# EAGLE schematic BeagleBone_Black_egl (EAGLE 6.2), part 2 of 2
## Sheet 10 of 11
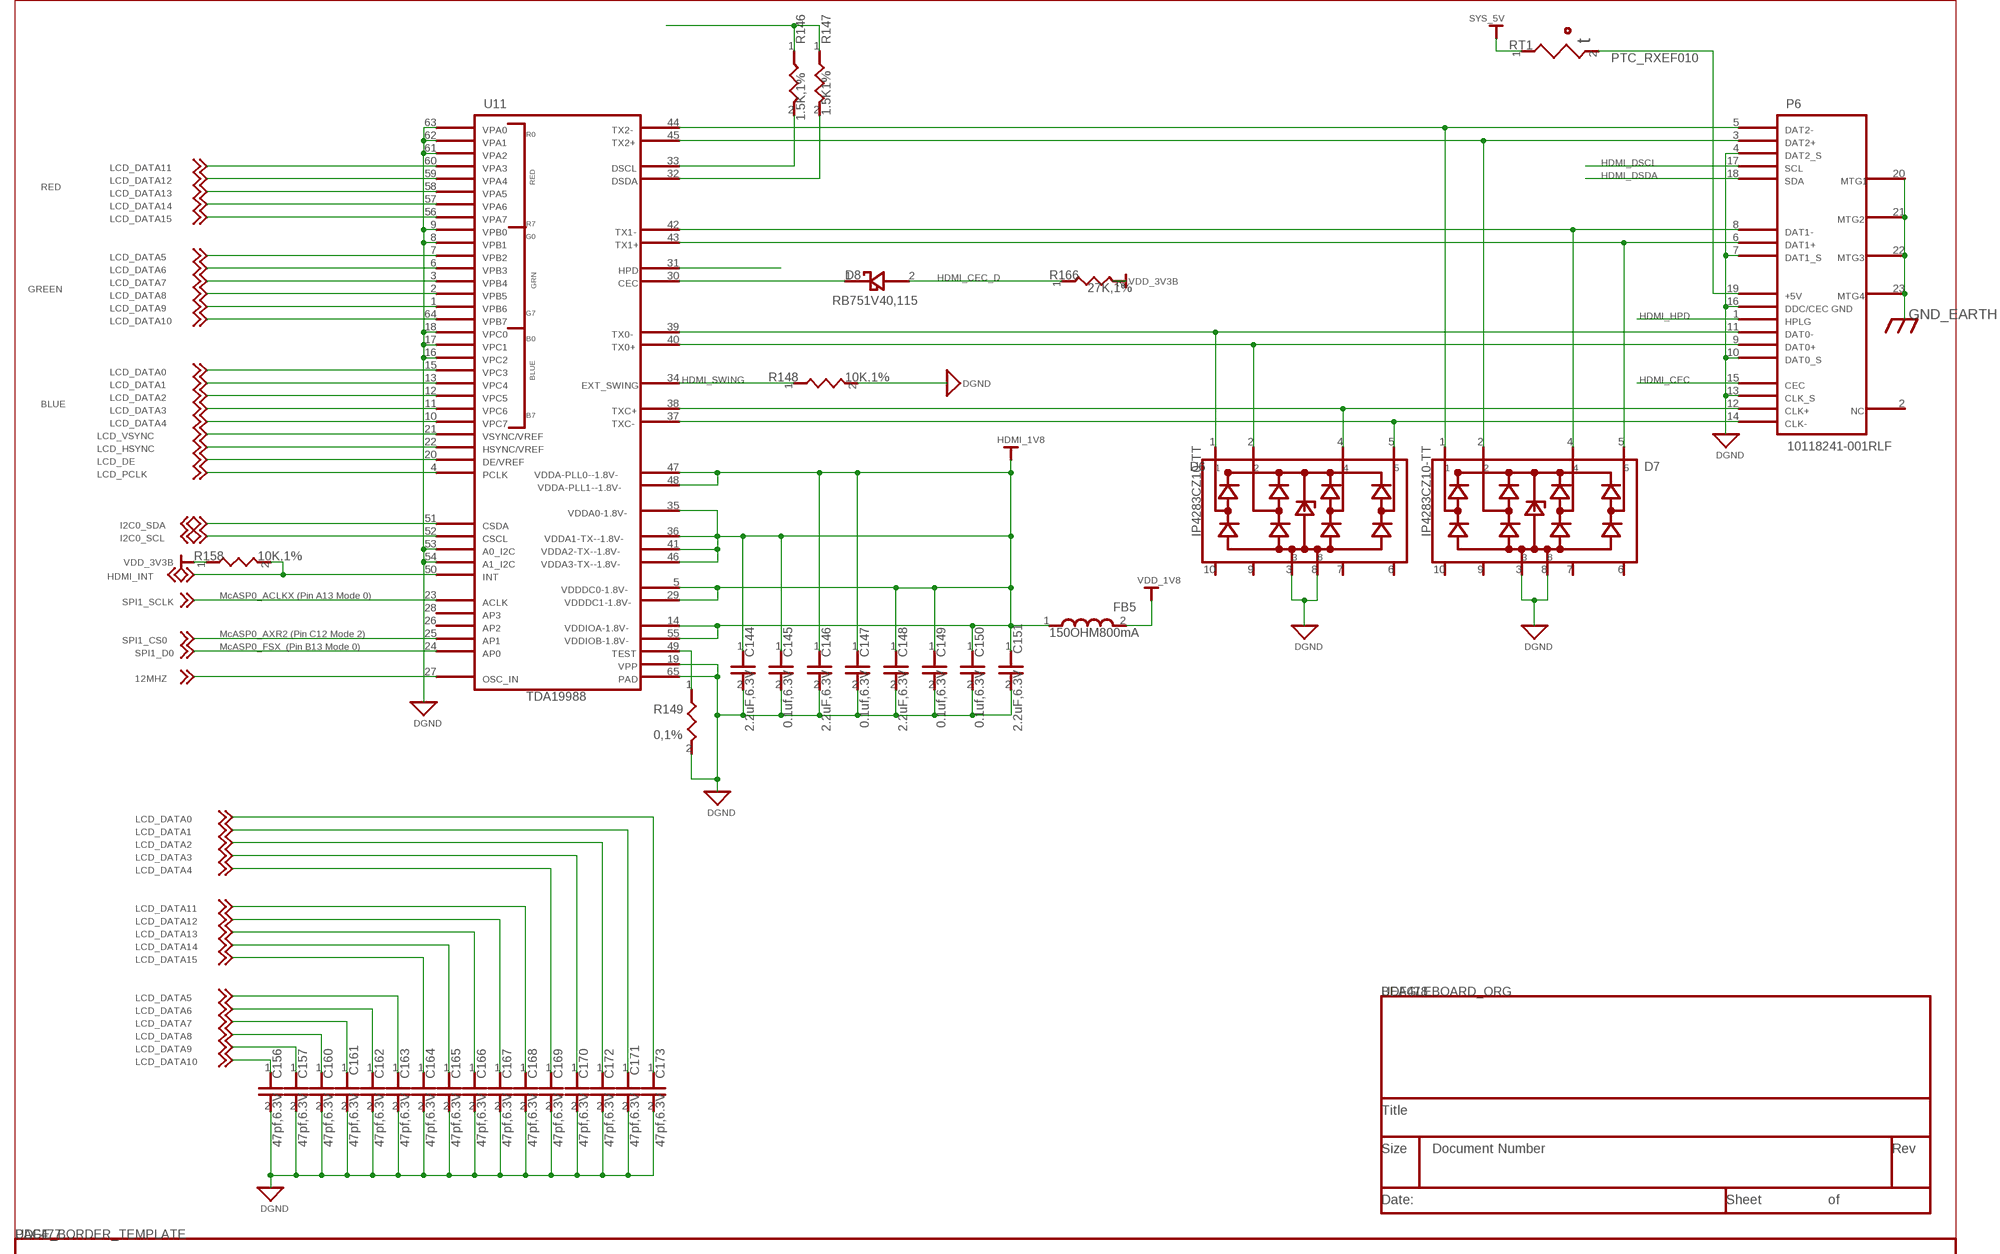
[diagram p12: schematic, sheet 10]

### Parts
C144  2.2uF,6.3V  CAP_2.2UF_X5R_6.3V_10%_0402_402  [402]
C145  0.1uf,6.3V  CAP_0.1UF_X5R_6.3V_20%_0201__40  [402]
C146  2.2uF,6.3V  CAP_2.2UF_X5R_6.3V_10%_0402_402  [402]
C147  0.1uf,6.3V  CAP_0.1UF_X5R_6.3V_20%_0201__40  [402]
C148  2.2uF,6.3V  CAP_2.2UF_X5R_6.3V_10%_0402_402  [402]
C149  0.1uf,6.3V  CAP_0.1UF_X5R_6.3V_20%_0201__40  [402]
C150  0.1uf,6.3V  CAP_0.1UF_X5R_6.3V_20%_0201__40  [402]
C151  2.2uF,6.3V  CAP_2.2UF_X5R_6.3V_10%_0402_402  [402]
C156  47pf,6.3V  CAP_0.1UF_X5R_6.3V_20%_0201_1  [402]
C157  47pf,6.3V  CAP_0.1UF_X5R_6.3V_20%_0201_1  [402]
C160  47pf,6.3V  CAP_0.1UF_X5R_6.3V_20%_0201_1  [402]
C161  47pf,6.3V  CAP_0.1UF_X5R_6.3V_20%_0201_1  [402]
C162  47pf,6.3V  CAP_0.1UF_X5R_6.3V_20%_0201_1  [402]
C163  47pf,6.3V  CAP_0.1UF_X5R_6.3V_20%_0201_1  [402]
C164  47pf,6.3V  CAP_0.1UF_X5R_6.3V_20%_0201_1  [402]
C165  47pf,6.3V  CAP_0.1UF_X5R_6.3V_20%_0201_1  [402]
C166  47pf,6.3V  CAP_0.1UF_X5R_6.3V_20%_0201_1  [402]
C167  47pf,6.3V  CAP_0.1UF_X5R_6.3V_20%_0201_1  [402]
C168  47pf,6.3V  CAP_0.1UF_X5R_6.3V_20%_0201_1  [402]
C169  47pf,6.3V  CAP_0.1UF_X5R_6.3V_20%_0201_1  [402]
C170  47pf,6.3V  CAP_0.1UF_X5R_6.3V_20%_0201_1  [402]
C171  47pf,6.3V  CAP_0.1UF_X5R_6.3V_20%_0201_1  [402]
C172  47pf,6.3V  CAP_0.1UF_X5R_6.3V_20%_0201_1  [402]
C173  47pf,6.3V  CAP_0.1UF_X5R_6.3V_20%_0201_1  [402]
D6  IP4283CZ10-TT  32CTQ030/TO_1_TSSOP10_IP4283CZ1  [TSSOP10]
D7  IP4283CZ10-TT  32CTQ030/TO_1_TSSOP10_IP4283CZ1  [TSSOP10]
D8  RB751V40,115  DIO_SR305_TH_0_SOD323_RB751V40_  [SOD323]
FB5  150OHM800mA  FER_180_200_0805_SM-7351-IND-08  [SM-7351-IND-0805]
P6  10118241-001RLF  CONN_HDMI_TYPED_CONN19_HDMI_101  [CONN19_HDMI]
R146  1.5K,1%  RES_1.5K_1/16W_5%_0402_402_1.5K_2  [402]
R147  1.5K1%  RES_1.5K_1/16W_5%_0402_402_1._1  [402]
R148  10K,1%  RES_10K_1/16W_1%_0402_402_10K_1_2  [402]
R149  0,1%  RES_0_1/16W_1%_0402_402_0_1%_2  [402]
R158  10K,1%  RES_10K_1/16W_1%_0402_402_10K_1_2  [402]
R166  27K,1%  RES_22.6K_1/16W_1%_0402_402_27K  [402]
RT1  PTC_RXEF010  PTC_RXEF010_POLYSW200-5638-310_  [POLYSW200-5638-310]
U11  TDA19988  IC_TDA19988_HVQFN64_5_QFN64S9X9  [QFN64S9X9P5]

### Nets
12MHZ: U11.27 ; also sheet 3
DGND: C144.2 C145.2 C146.2 C147.2 C148.2 C149.2 C150.2 C151.2 C156.2 C157.2 C160.2 C161.2 C162.2 C163.2 C164.2 C165.2 C166.2 C167.2 C168.2 C169.2 C170.2 C171.2 C172.2 C173.2 D6.3 D6.8 D7.3 D7.8 P6.4 P6.7 P6.10 P6.13 P6.16 R148.2 R149.2 U11.8 U11.9 U11.16 U11.17 U11.18 U11.19 U11.53 U11.54 U11.61 U11.62 U11.63 U11.65 ; supply symbol labelled GND_SIGNAL_DGND ; also sheet 2,3,4,5,6,7,8,9,11
DVI_+5V: P6.19 R146.1 R147.1 RT1.2
GND_EARTH: P6.20 P6.21 P6.22 P6.23 ; supply symbol labelled GND_EARTH_GND_EARTH ; also sheet 2,4,9,11
HDMI_1V8: C144.1 C145.1 C146.1 C147.1 C148.1 C149.1 C150.1 C151.1 FB5.1 U11.5 U11.14 U11.29 U11.35 U11.36 U11.41 U11.46 U11.47 U11.48 U11.55 ; supply symbol labelled VCC_BAR_HDMI_1V8
HDMI_CEC: D8.1 P6.15 U11.30
HDMI_CEC_D: D8.2 R166.1
HDMI_DSCL: P6.17 R146.2 U11.33
HDMI_DSDA: P6.18 R147.2 U11.32
HDMI_HPD: P6.1 U11.31
HDMI_INT: R158.2 U11.50 ; also sheet 3
HDMI_SWING: R148.1 U11.34
HDMI_TX0+: D6.2 P6.9 U11.40
HDMI_TX0-: D6.1 P6.11 U11.39
HDMI_TX1+: D7.5 P6.6 U11.43
HDMI_TX1-: D7.4 P6.8 U11.42
HDMI_TX2+: D7.2 P6.3 U11.45
HDMI_TX2-: D7.1 P6.5 U11.44
HDMI_TXC+: D6.4 P6.12 U11.38
HDMI_TXC-: D6.5 P6.14 U11.37
I2C0_SCL: U11.52 ; also sheet 2,4,11
I2C0_SDA: U11.51 ; also sheet 2,4,11
LCD_DATA0: C173.1 U11.15 ; also sheet 4,6,11
LCD_DATA1: C171.1 U11.13 ; also sheet 4,6,11
LCD_DATA2: C172.1 U11.12 ; also sheet 4,6,11
LCD_DATA3: C170.1 U11.11 ; also sheet 4,6,11
LCD_DATA4: C169.1 U11.10 ; also sheet 4,6,11
LCD_DATA5: C163.1 U11.7 ; also sheet 4,6,11
LCD_DATA6: C162.1 U11.6 ; also sheet 4,6,11
LCD_DATA7: C161.1 U11.3 ; also sheet 4,6,11
LCD_DATA8: C160.1 U11.2 ; also sheet 4,6,11
LCD_DATA9: C157.1 U11.1 ; also sheet 4,6,11
LCD_DATA10: C156.1 U11.64 ; also sheet 4,6,11
LCD_DATA11: C168.1 U11.60 ; also sheet 4,6,11
LCD_DATA12: C167.1 U11.59 ; also sheet 4,6,11
LCD_DATA13: C166.1 U11.58 ; also sheet 4,6,11
LCD_DATA14: C165.1 U11.57 ; also sheet 4,6,11
LCD_DATA15: C164.1 U11.56 ; also sheet 4,6,11
LCD_DE: U11.20 ; also sheet 4,11
LCD_HSYNC: U11.22 ; also sheet 4,11
LCD_PCLK: U11.4 ; also sheet 4,11
LCD_VSYNC: U11.21 ; also sheet 4,11
N21667305: R149.1 U11.49
SPI1_CS0: U11.25 ; also sheet 4,11
SPI1_D0: U11.24 ; also sheet 4,11
SPI1_SCLK: U11.23 ; also sheet 4,11
SYS_5V: RT1.1 ; supply symbol labelled VCC_BAR_SYS_5V ; also sheet 2,4,6,11
VDD_1V8: FB5.2 ; supply symbol labelled VCC_BAR_VDD_1V8 ; also sheet 2,5
VDD_3V3B: R158.1 R166.2 ; supply symbol labelled VCC_BAR_VDD_3V3B ; also sheet 2,3,4,8,9,11
Unconnected: D6.6 D6.7 D6.9 D6.10 D7.6 D7.7 D7.9 D7.10 P6.2 U11.26 U11.28

### Notes on the sheet
- SYS_5V
- HDMI_DSCL
- LCD_DATA11
- HDMI_DSDA
- LCD_DATA12
- RED
- LCD_DATA13
- LCD_DATA14
- LCD_DATA15
- LCD_DATA5
- LCD_DATA6
- HDMI_CEC_D
- LCD_DATA7 | VDD_3V3B
- GREEN
- LCD_DATA8
- LCD_DATA9
- HDMI_HPD | GND_EARTH
- LCD_DATA10
- LCD_DATA0
- HDMI_SWING | HDMI_CEC
- LCD_DATA1 | DGND
- LCD_DATA2
- BLUE
- LCD_DATA3
- LCD_DATA4
- LCD_VSYNC
- HDMI_1V8
- LCD_HSYNC
- DGND
- LCD_DE
- LCD_PCLK
- I2C0_SDA
- I2C0_SCL
- VDD_3V3B
- HDMI_INT
- VDD_1V8
- McASP0_ACLKX (Pin A13 Mode 0)
- SPI1_SCLK
- McASP0_AXR2 (Pin C12 Mode 2)
- SPI1_CS0
- McASP0_FSX  (Pin B13 Mode 0) | DGND | DGND
- SPI1_D0
- 12MHZ
- DGND
- DGND
- LCD_DATA0
- LCD_DATA1
- LCD_DATA2
- LCD_DATA3
- LCD_DATA4
- LCD_DATA11
- LCD_DATA12
- LCD_DATA13
- LCD_DATA14
- LCD_DATA15
- LCD_DATA5
- LCD_DATA6
- LCD_DATA7
- LCD_DATA8
- LCD_DATA9
- LCD_DATA10
- DGND

## Sheet 11 of 11
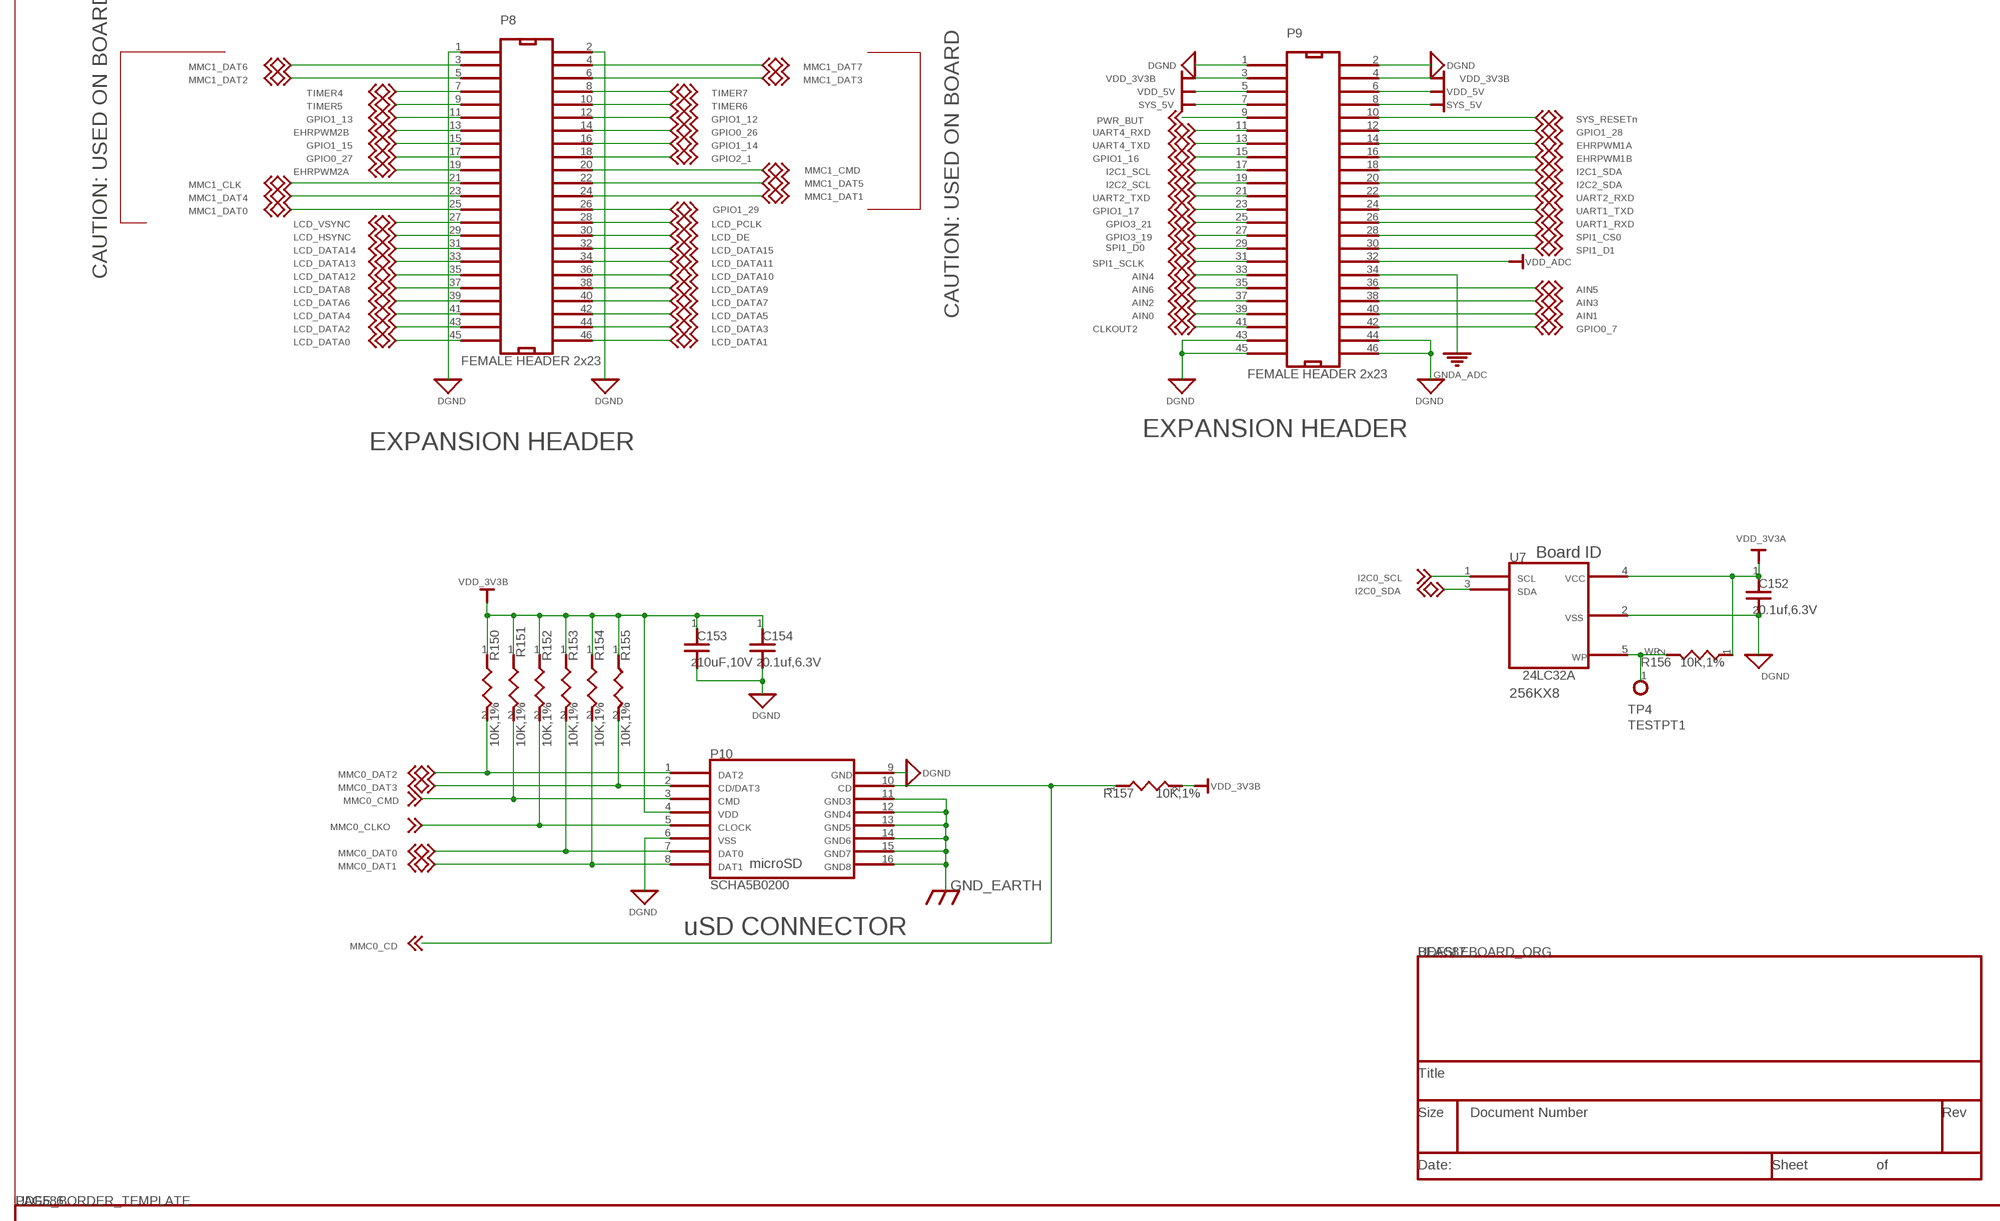
[diagram p13: schematic, sheet 11]

### Parts
C152  0.1uf,6.3V  CAP_0.1UF_X5R_6.3V_20%_0201__40  [402]
C153  10uF,10V  CAP_10UF_Y5V_10V_10%_0805_805_1  [805]
C154  0.1uf,6.3V  CAP_0.1UF_X5R_6.3V_20%_0201__40  [402]
P8  FEMALE HEADER 2x23  HDR_46_F_2_0.1_0.1_HEADER23X2_F  [HEADER23X2]
P9  FEMALE HEADER 2x23  HDR_46_F_2_0.1_0.1_HEADER23X2_F  [HEADER23X2]
P10  SCHA5B0200  MICROSD_CONN_8_SD-MICRO-SCHA5B0  [SD-MICRO-SCHA5B0300]
R150  10K,1%  RES_10K_1/16W_1%_0402_402_10K_1  [402]
R151  10K,1%  RES_10K_1/16W_1%_0402_402_10K_1  [402]
R152  10K,1%  RES_10K_1/16W_1%_0402_402_10K_1  [402]
R153  10K,1%  RES_10K_1/16W_1%_0402_402_10K_1  [402]
R154  10K,1%  RES_10K_1/16W_1%_0402_402_10K_1  [402]
R155  10K,1%  RES_10K_1/16W_1%_0402_402_10K_1  [402]
R156  10K,1%  RES_0_1/16W_1%_0402_402_10K_1%  [402]
R157  10K,1%  RES_10K_1/16W_1%_0402_402_10K_1  [402]
TP4  TESTPT1  TESTPT1_TP1-8040  [TP1-8040]
U7  24LC32A  MEM_24LC32_SOT23-5_SOT23-5_24LC  [SOT23-5]

### Nets
AIN0: P9.39 ; also sheet 4
AIN1: P9.40 ; also sheet 4
AIN2: P9.37 ; also sheet 4
AIN3: P9.38 ; also sheet 4
AIN4: P9.33 ; also sheet 4
AIN5: P9.36 ; also sheet 4
AIN6: P9.35 ; also sheet 4
CLKOUT2: P9.41 ; also sheet 3
DGND: C152.2 C153.2 C154.2 P8.1 P8.2 P9.1 P9.2 P9.43 P9.44 P9.45 P9.46 P10.6 P10.9 U7.2 ; supply symbol labelled GND_SIGNAL_DGND, GND_SIGNAL_2_DGND ; also sheet 2,3,4,5,6,7,8,9,10
EHRPWM1A: P9.14 ; also sheet 3
EHRPWM1B: P9.16 ; also sheet 3
EHRPWM2A: P8.19 ; also sheet 3
EHRPWM2B: P8.13 ; also sheet 3
GND_EARTH: P10.11 P10.12 P10.13 P10.14 P10.15 P10.16 ; supply symbol labelled GND_EARTH_GND_EARTH ; also sheet 2,4,9,10
GNDA_ADC: P9.34 ; supply symbol labelled GND_POWER_GNDA_ADC ; also sheet 4,5
GPIO0_7: P9.42 ; also sheet 4
GPIO0_26: P8.14 ; also sheet 3
GPIO0_27: P8.17 ; also sheet 3
GPIO1_12: P8.12 ; also sheet 3
GPIO1_13: P8.11 ; also sheet 3
GPIO1_14: P8.16 ; also sheet 3
GPIO1_15: P8.15 ; also sheet 3
GPIO1_16: P9.15 ; also sheet 3
GPIO1_17: P9.23 ; also sheet 3
GPIO1_28: P9.12 ; also sheet 3
GPIO1_29: P8.26 ; also sheet 3
GPIO2_1: P8.18 ; also sheet 3
GPIO3_19: P9.27 ; also sheet 4
GPIO3_21: P9.25 ; also sheet 3,4
I2C0_SCL: U7.1 ; also sheet 2,4,10
I2C0_SDA: U7.3 ; also sheet 2,4,10
I2C1_SCL: P9.17 ; also sheet 4
I2C1_SDA: P9.18 ; also sheet 4
I2C2_SCL: P9.19 ; also sheet 4
I2C2_SDA: P9.20 ; also sheet 4
LCD_DATA0: P8.45 ; also sheet 4,6,10
LCD_DATA1: P8.46 ; also sheet 4,6,10
LCD_DATA2: P8.43 ; also sheet 4,6,10
LCD_DATA3: P8.44 ; also sheet 4,6,10
LCD_DATA4: P8.41 ; also sheet 4,6,10
LCD_DATA5: P8.42 ; also sheet 4,6,10
LCD_DATA6: P8.39 ; also sheet 4,6,10
LCD_DATA7: P8.40 ; also sheet 4,6,10
LCD_DATA8: P8.37 ; also sheet 4,6,10
LCD_DATA9: P8.38 ; also sheet 4,6,10
LCD_DATA10: P8.36 ; also sheet 4,6,10
LCD_DATA11: P8.34 ; also sheet 4,6,10
LCD_DATA12: P8.35 ; also sheet 4,6,10
LCD_DATA13: P8.33 ; also sheet 4,6,10
LCD_DATA14: P8.31 ; also sheet 4,6,10
LCD_DATA15: P8.32 ; also sheet 4,6,10
LCD_DE: P8.30 ; also sheet 4,10
LCD_HSYNC: P8.29 ; also sheet 4,10
LCD_PCLK: P8.28 ; also sheet 4,10
LCD_VSYNC: P8.27 ; also sheet 4,10
MMC0_CD: P10.10 R157.1 ; also sheet 3,4
MMC0_CLKO: P10.5 R152.2 ; also sheet 3
MMC0_CMD: P10.3 R151.2 ; also sheet 3
MMC0_DAT0: P10.7 R153.2 ; also sheet 3
MMC0_DAT1: P10.8 R154.2 ; also sheet 3
MMC0_DAT2: P10.1 R150.2 ; also sheet 3
MMC0_DAT3: P10.2 R155.2 ; also sheet 3
MMC1_CLK: P8.21 ; also sheet 3,8
MMC1_CMD: P8.20 ; also sheet 3,8
MMC1_DAT0: P8.25 ; also sheet 3,8
MMC1_DAT1: P8.24 ; also sheet 3,8
MMC1_DAT2: P8.5 ; also sheet 3,8
MMC1_DAT3: P8.6 ; also sheet 3,8
MMC1_DAT4: P8.23 ; also sheet 3,8
MMC1_DAT5: P8.22 ; also sheet 3,8
MMC1_DAT6: P8.3 ; also sheet 3,8
MMC1_DAT7: P8.4 ; also sheet 3,8
PWR_BUT: P9.9 ; also sheet 2
SPI1_CS0: P9.28 ; also sheet 4,10
SPI1_D0: P9.29 ; also sheet 4,10
SPI1_D1: P9.30 ; also sheet 4
SPI1_SCLK: P9.31 ; also sheet 4,10
SYS_5V: P9.7 P9.8 ; supply symbol labelled VCC_BAR_SYS_5V ; also sheet 2,4,6,10
SYS_RESETN: P9.10 ; also sheet 3,9
TIMER4: P8.7 ; also sheet 3
TIMER5: P8.9 ; also sheet 3
TIMER6: P8.10 ; also sheet 3
TIMER7: P8.8 ; also sheet 3
UART1_RXD: P9.26 ; also sheet 4
UART1_TXD: P9.24 ; also sheet 4
UART2_RXD: P9.22 ; also sheet 4
UART2_TXD: P9.21 ; also sheet 4
UART4_RXD: P9.11 ; also sheet 3
UART4_TXD: P9.13 ; also sheet 3
VDD_3V3A: C152.1 R156.1 U7.4 ; supply symbol labelled VDD_1V8_VDD_3V3A ; also sheet 2,3,4,5,6
VDD_3V3B: C153.1 C154.1 P9.3 P9.4 P10.4 R150.1 R151.1 R152.1 R153.1 R154.1 R155.1 R157.2 ; supply symbol labelled VCC_BAR_VDD_3V3B ; also sheet 2,3,4,8,9,10
VDD_5V: P9.5 P9.6 ; supply symbol labelled VCC_BAR_VDD_5V ; also sheet 2
VDD_ADC: P9.32 ; supply symbol labelled VCC_BAR_VDD_ADC ; also sheet 4,5
WP: R156.2 TP4.1 U7.5

### Notes on the sheet
- MMC1_DAT6 | MMC1_DAT7 | DGND | DGND
- MMC1_DAT2 | MMC1_DAT3 | VDD_3V3B | VDD_3V3B
- TIMER4 | TIMER7 | VDD_5V | VDD_5V
- TIMER5 | TIMER6 | SYS_5V | SYS_5V
- GPIO1_13 | GPIO1_12 | PWR_BUT | SYS_RESETn
- EHRPWM2B | GPIO0_26 | UART4_RXD | GPIO1_28
- GPIO1_15 | GPIO1_14 | UART4_TXD | EHRPWM1A
- GPIO0_27 | GPIO2_1 | GPIO1_16 | EHRPWM1B
- EHRPWM2A | MMC1_CMD | I2C1_SCL | I2C1_SDA
- MMC1_CLK | MMC1_DAT5 | I2C2_SCL | I2C2_SDA
- MMC1_DAT4 | MMC1_DAT1 | UART2_TXD | UART2_RXD
- MMC1_DAT0 | GPIO1_29 | GPIO1_17 | UART1_TXD
- LCD_VSYNC | LCD_PCLK | GPIO3_21 | UART1_RXD
- LCD_HSYNC | LCD_DE | GPIO3_19 | SPI1_CS0
- LCD_DATA14 | LCD_DATA15 | SPI1_D0 | SPI1_D1
- LCD_DATA13 | LCD_DATA11 | SPI1_SCLK | VDD_ADC
- CAUTION: USED ON BOARD | LCD_DATA12 | LCD_DATA10 | AIN4
- LCD_DATA8 | LCD_DATA9 | AIN6 | AIN5
- LCD_DATA6 | LCD_DATA7 | AIN2 | AIN3
- LCD_DATA4 | LCD_DATA5 | CAUTION: USED ON BOARD | AIN0 | AIN1
- LCD_DATA2 | LCD_DATA3 | CLKOUT2 | GPIO0_7
- LCD_DATA0 | LCD_DATA1
- GNDA_ADC
- DGND | DGND | DGND | DGND
- EXPANSION HEADER
- EXPANSION HEADER
- VDD_3V3A
- Board ID
- I2C0_SCL
- VDD_3V3B
- I2C0_SDA
- WP
- DGND
- 256KX8
- DGND
- MMC0_DAT2 | DGND
- MMC0_DAT3 | VDD_3V3B
- MMC0_CMD
- MMC0_CLKO
- MMC0_DAT0
- MMC0_DAT1
- GND_EARTH
- DGND
- uSD CONNECTOR
- MMC0_CD

## Library data of the parts
C1 C2 C4 C7-C15 C39 C40 C55 C62 C77 C95 C96 C118 C122 C126 C133 C153 = BeagleBone_Black_egl:CAP_10UF_Y5V_10V_10%_0805_805_1: CAP_10UF_Y5V_10V_10%_0805_805_1
C3 C20 C27-C31 C33 C35-C38 C41-C54 C56-C61 C63-C76 C78-C88 C92-C94 C97-C103 C105-C117 C119-C121 C124 C127-C132 C135 C145 C147 C149 C150 C152 C154 C155 C158 C159 = BeagleBone_Black_egl:CAP_0.1UF_X5R_6.3V_20%_0201__40: CAP_0.1UF_X5R_6.3V_20%_0201__40
C16-C18 C125 C144 C146 C148 C151 = BeagleBone_Black_egl:CAP_2.2UF_X5R_6.3V_10%_0402_402: CAP_2.2UF_X5R_6.3V_10%_0402_402
C19 = BeagleBone_Black_egl:CAP_470PF_X7R_25V_10%_0402_402_: CAP_470PF_X7R_25V_10%_0402_402_
C21 C22 C25 C26 = BeagleBone_Black_egl:CAP_18PF_COG_50V_5%_0402_402_18: CAP_18PF_COG_50V_5%_0402_402_18
C24 C89-C91 C104 C134 = BeagleBone_Black_egl:CAP_1.0UF_X5R_10V_10%_0402_402_: CAP_1.0UF_X5R_10V_10%_0402_402_
C32 C123 = BeagleBone_Black_egl:CAP_0.001_X7R_50V_5%_0402_402_0: CAP_0.001_X7R_50V_5%_0402_402_0
C34 = BeagleBone_Black_egl:CAP_100UF_TANT_6.3V_3528-21_RD2: CAP_100UF_TANT_6.3V_3528-21_RD2
C136 = BeagleBone_Black_egl:470PF/5%/50V/C0G/0603_0_0402_47: 470PF/5%/50V/C0G/0603_0_0402_47
C137-C140 = BeagleBone_Black_egl:CAP_0402_100PF_COG_50V_402_15PF: CAP_0402_100PF_COG_50V_402_15PF
C141 = BeagleBone_Black_egl:CAP_0402_0.1UF_X5R_10V_402_0.02: CAP_0402_0.1UF_X5R_10V_402_0.02
C142 C143 = BeagleBone_Black_egl:CAP_30PF_COG_50V_5%_0402_402_30: CAP_30PF_COG_50V_5%_0402_402_30
C156 C157 C160-C173 = BeagleBone_Black_egl:CAP_0.1UF_X5R_6.3V_20%_0201_1: CAP_0.1UF_X5R_6.3V_20%_0201_1
D1-D5 = BeagleBone_Black_egl:LED_LTST-C150GKT_0_LED_0603_DIS: LED_LTST-C150GKT_0_LED_0603_DIS
D6 D7 = BeagleBone_Black_egl:32CTQ030/TO_1_TSSOP10_IP4283CZ1: 32CTQ030/TO_1_TSSOP10_IP4283CZ1
D8 = BeagleBone_Black_egl:DIO_SR305_TH_0_SOD323_RB751V40_: DIO_SR305_TH_0_SOD323_RB751V40_
FB1-FB4 FB7 = BeagleBone_Black_egl:FER_180_200_0_SM-7351-IND-0805_: FER_180_200_0_SM-7351-IND-0805_
FB5 = BeagleBone_Black_egl:FER_180_200_0805_SM-7351-IND-08: FER_180_200_0805_SM-7351-IND-08
FB8 = BeagleBone_Black_egl:FER_180_200_0_SM-7351-IND-080_1: FER_180_200_0_SM-7351-IND-080_1
J1 = BeagleBone_Black_egl:HEADER_6_SIP6_HEADER_6: HEADER_6_SIP6_HEADER_6
L1-L3 = BeagleBone_Black_egl:IND_2.2UH_2.6A_10%_SMD_2520_LQM: IND_2.2UH_2.6A_10%_SMD_2520_LQM
MTG1-MTG4 = BeagleBone_Black_egl:MHOLE_MTGH200C125D_PL_MHOLE: MHOLE_MTGH200C125D_PL_MHOLE
P1 = BeagleBone_Black_egl:POWER_JACK_CONN3-PWR-PJ102A_PJ-: POWER_JACK_CONN3-PWR-PJ102A_PJ-
P2 = BeagleBone_Black_egl:HDR_10X2_CJTAG_0_HEADER10X2_SMD: HDR_10X2_CJTAG_0_HEADER10X2_SMD
P3 = BeagleBone_Black_egl:CONN_54819-0578_2_USB_A_SH_IO_8: CONN_54819-0578_2_USB_A_SH_IO_8
P4 = BeagleBone_Black_egl:MINI-USB-AB-SOCKET_USB5MINI_4SH: MINI-USB-AB-SOCKET_USB5MINI_4SH
P5 = BeagleBone_Black_egl:CONN_RJ45_MAG_WE_0_RJ45-7499010: CONN_RJ45_MAG_WE_0_RJ45-7499010
P6 = BeagleBone_Black_egl:CONN_HDMI_TYPED_CONN19_HDMI_101: CONN_HDMI_TYPED_CONN19_HDMI_101
P8 P9 = BeagleBone_Black_egl:HDR_46_F_2_0.1_0.1_HEADER23X2_F: HDR_46_F_2_0.1_0.1_HEADER23X2_F
P10 = BeagleBone_Black_egl:MICROSD_CONN_8_SD-MICRO-SCHA5B0: MICROSD_CONN_8_SD-MICRO-SCHA5B0
Q1 Q2 = BeagleBone_Black_egl:RN1907_SMINI6-F3-B_DMC56404: RN1907_SMINI6-F3-B_DMC56404
R1 R56 R65-R68 R76-R80 R82-R89 R94 R95 R165 = BeagleBone_Black_egl:RES_100K_1/16W_1%_0402_402_100K: RES_100K_1/16W_1%_0402_402_100K
R3 R4 R119 = BeagleBone_Black_egl:RES_1.5K_1/16W_5%_0402_402_1.5K: RES_1.5K_1/16W_5%_0402_402_1.5K
R5-R7 R9 R50 R51 R159-R162 = BeagleBone_Black_egl:RES_4.75K_1/16W_1%_0402_402_0_1: RES_4.75K_1/16W_1%_0402_402_0_1
R8 = BeagleBone_Black_egl:RES_4.75K_1/16W_1%_0402_402_0_D: RES_4.75K_1/16W_1%_0402_402_0_D
R10 = BeagleBone_Black_egl:RES_470_1/10W_5%_0402_402_470K_: RES_470_1/10W_5%_0402_402_470K_
R11 = BeagleBone_Black_egl:RES_470_1/10W_5%_0402_402_280K_: RES_470_1/10W_5%_0402_402_280K_
R12 = BeagleBone_Black_egl:RES_470_1/10W_5%_0402_402_820_5_2: RES_470_1/10W_5%_0402_402_820_5_2
R14 R52-R54 R98 R100-R111 R135 R145 R150-R155 R157 = BeagleBone_Black_egl:RES_10K_1/16W_1%_0402_402_10K_1: RES_10K_1/16W_1%_0402_402_10K_1
R17 = BeagleBone_Black_egl:RES_1M_1/16W_1%_0402_402_1M_1%: RES_1M_1/16W_1%_0402_402_1M_1%
R18 R21 R28 R45-R48 R167 = BeagleBone_Black_egl:RES_33_0402_0402_33: RES_33_0402_0402_33
R19 R20 R27 R142 = BeagleBone_Black_egl:RES_0_1/16W_1%_0402_402_0_1%: RES_0_1/16W_1%_0402_402_0_1%
R22 R120-R123 = BeagleBone_Black_egl:RES_4.7K_0402_402_49.9_1%: RES_4.7K_0402_402_49.9_1%
R23-R26 R163 R164 = BeagleBone_Black_egl:RES_4.75K_1/16W_1%_0402_402_4.7: RES_4.75K_1/16W_1%_0402_402_4.7
R49 = BeagleBone_Black_egl:RES_100K_1/16W_1%_0402_402_0_1%: RES_100K_1/16W_1%_0402_402_0_1%
R55 R57-R64 R69 R70 R81 R90-R93 = BeagleBone_Black_egl:RES_100K_1/16W_1%_0402_402_10_1: RES_100K_1/16W_1%_0402_402_10_1
R71-R74 = BeagleBone_Black_egl:RES_470_1/10W_5%_0402_402_820_5: RES_470_1/10W_5%_0402_402_820_5
R75 = BeagleBone_Black_egl:RES_100K_1/16W_1%_0402_402_100_: RES_100K_1/16W_1%_0402_402_100_
R96 R148 R158 = BeagleBone_Black_egl:RES_10K_1/16W_1%_0402_402_10K_1_2: RES_10K_1/16W_1%_0402_402_10K_1_2
R97 = BeagleBone_Black_egl:RES_10K_1/16W_1%_0402_402_1.5K_: RES_10K_1/16W_1%_0402_402_1.5K_
R99 = BeagleBone_Black_egl:RES_SM-7351-RES-0402_240: RES_SM-7351-RES-0402_240
R112-R114 = BeagleBone_Black_egl:RES_4.75K_1/16W_1%_0402_402_1.5: RES_4.75K_1/16W_1%_0402_402_1.5
R115-R118 = BeagleBone_Black_egl:RES_4.75K_1/16W_1%_0402_402_10K: RES_4.75K_1/16W_1%_0402_402_10K
R124 = BeagleBone_Black_egl:100-1/10W-1%-0603_4_402_10_1%_D: 100-1/10W-1%-0603_4_402_10_1%_D
R125 R126 R129 R134 R138 = BeagleBone_Black_egl:100-1/10W-1%-0603_4_402_100_1%: 100-1/10W-1%-0603_4_402_100_1%
R127 R128 R131 R133 R139 = BeagleBone_Black_egl:RES_100_1/10W_5%_0402_402_100_1: RES_100_1/10W_5%_0402_402_100_1
R130 R132 = BeagleBone_Black_egl:RES_470_1/10W_5%_0402_402_470_5: RES_470_1/10W_5%_0402_402_470_5
R136 = BeagleBone_Black_egl:RES_0.1_0805_805_.1_0805: RES_0.1_0805_805_.1_0805
R137 = BeagleBone_Black_egl:RES_10K_1/16W_1%_0402_402_0_1%: RES_10K_1/16W_1%_0402_402_0_1%
R140 = BeagleBone_Black_egl:RES_0_1/16W_1%_0402_402_0_1%_DN: RES_0_1/16W_1%_0402_402_0_1%_DN
R141 = BeagleBone_Black_egl:RES_1M_1/16W_1%_0402_402_1M_1%_: RES_1M_1/16W_1%_0402_402_1M_1%_
R143 = BeagleBone_Black_egl:RES_10K_1/16W_1%_0402_402_10_1%: RES_10K_1/16W_1%_0402_402_10_1%
R144 = BeagleBone_Black_egl:RES_12.1K_1/16W_1%_0402_402_12.: RES_12.1K_1/16W_1%_0402_402_12.
R146 = BeagleBone_Black_egl:RES_1.5K_1/16W_5%_0402_402_1.5K_2: RES_1.5K_1/16W_5%_0402_402_1.5K_2
R147 = BeagleBone_Black_egl:RES_1.5K_1/16W_5%_0402_402_1._1: RES_1.5K_1/16W_5%_0402_402_1._1
R149 = BeagleBone_Black_egl:RES_0_1/16W_1%_0402_402_0_1%_2: RES_0_1/16W_1%_0402_402_0_1%_2
R156 = BeagleBone_Black_egl:RES_0_1/16W_1%_0402_402_10K_1%: RES_0_1/16W_1%_0402_402_10K_1%
R166 = BeagleBone_Black_egl:RES_22.6K_1/16W_1%_0402_402_27K: RES_22.6K_1/16W_1%_0402_402_27K
RT1 = BeagleBone_Black_egl:PTC_RXEF010_POLYSW200-5638-310_: PTC_RXEF010_POLYSW200-5638-310_
S1 S3 = BeagleBone_Black_egl:SW_KT11P2JM_2_SW4SMD_63X161LS_D: SW_KT11P2JM_2_SW4SMD_63X161LS_D
S2 = BeagleBone_Black_egl:SW_KT11P2JM_1_SW4SMD_63X161LS_D: SW_KT11P2JM_1_SW4SMD_63X161LS_D
TP1 TP4 = BeagleBone_Black_egl:TESTPT1_TP1-8040: TESTPT1_TP1-8040
TP2 TP3 = BeagleBone_Black_egl:TESTPT1_TP60C_SMD: TESTPT1_TP60C_SMD
TP5-TP8 = BeagleBone_Black_egl:TESTPT1_TP60C33D: TESTPT1_TP60C33D
U2 = BeagleBone_Black_egl:PWR_TPS65217_2_U_48_RSL_TPS6521: PWR_TPS65217_2_U_48_RSL_TPS6521
U3 = BeagleBone_Black_egl:IC_SN74LVC1G06DCK_0_DCK5_2P15X1: IC_SN74LVC1G06DCK_0_DCK5_2P15X1
U4 = BeagleBone_Black_egl:PWR_TLV70233DBV_0_SO8-25X75_TL5: PWR_TLV70233DBV_0_SO8-25X75_TL5
U5 = BeagleBone_Black_egl:IC_AM335X_ZCZ_AM33XX_15X15_XAM3: IC_AM335X_ZCZ_AM33XX_15X15_XAM3
U6 = BeagleBone_Black_egl:IC_SN74AUC1G74_SOP8_DCT_SN74AUC: IC_SN74AUC1G74_SOP8_DCT_SN74AUC
U7 = BeagleBone_Black_egl:MEM_24LC32_SOT23-5_SOT23-5_24LC: MEM_24LC32_SOT23-5_SOT23-5_24LC
U8 = BeagleBone_Black_egl:TPS2061_1_DGN-16X60_TPS2051__DG: TPS2061_1_DGN-16X60_TPS2051__DG
U9 U10 = BeagleBone_Black_egl:PROT_TPD4S012_U_6_DRY_TPD4S012: PROT_TPD4S012_U_6_DRY_TPD4S012
U11 = BeagleBone_Black_egl:IC_TDA19988_HVQFN64_5_QFN64S9X9: IC_TDA19988_HVQFN64_5_QFN64S9X9
U12 = BeagleBone_Black_egl:MT47H256M8_7_BGA96_T9_P8_9X14_M: MT47H256M8_7_BGA96_T9_P8_9X14_M
U13 = BeagleBone_Black_egl:MEM_MNAND_2GB_BGA153_P14_P5_11P: MEM_MNAND_2GB_BGA153_P14_P5_11P
U14 = BeagleBone_Black_egl:LAN8710_QFN32_1_QFN32_5X5MM_EP3: LAN8710_QFN32_1_QFN32_5X5MM_EP3
U15 = BeagleBone_Black_egl:IC_SN74LVC2G241_1_U_8_DCU_SN74L: IC_SN74LVC2G241_1_U_8_DCU_SN74L
Y1 = BeagleBone_Black_egl:CRYS_32_768KHZ_SMD32_1_XTAL4_12: CRYS_32_768KHZ_SMD32_1_XTAL4_12
Y2 = BeagleBone_Black_egl:CRYS_24MHZ_SCC_0_XTAL150SMD_125: CRYS_24MHZ_SCC_0_XTAL150SMD_125
Y3 = BeagleBone_Black_egl:SUNTSU_ITEMP_25MHZ__0.005%_20PF: SUNTSU_ITEMP_25MHZ__0.005%_20PF
Y4 = BeagleBone_Black_egl:OSC_12MHZ_1.3V_OSC4_61X65LS_79X: OSC_12MHZ_1.3V_OSC4_61X65LS_79X